# EAGLE design M_D_ext_power_usb_centered (EAGLE 9.6.2)
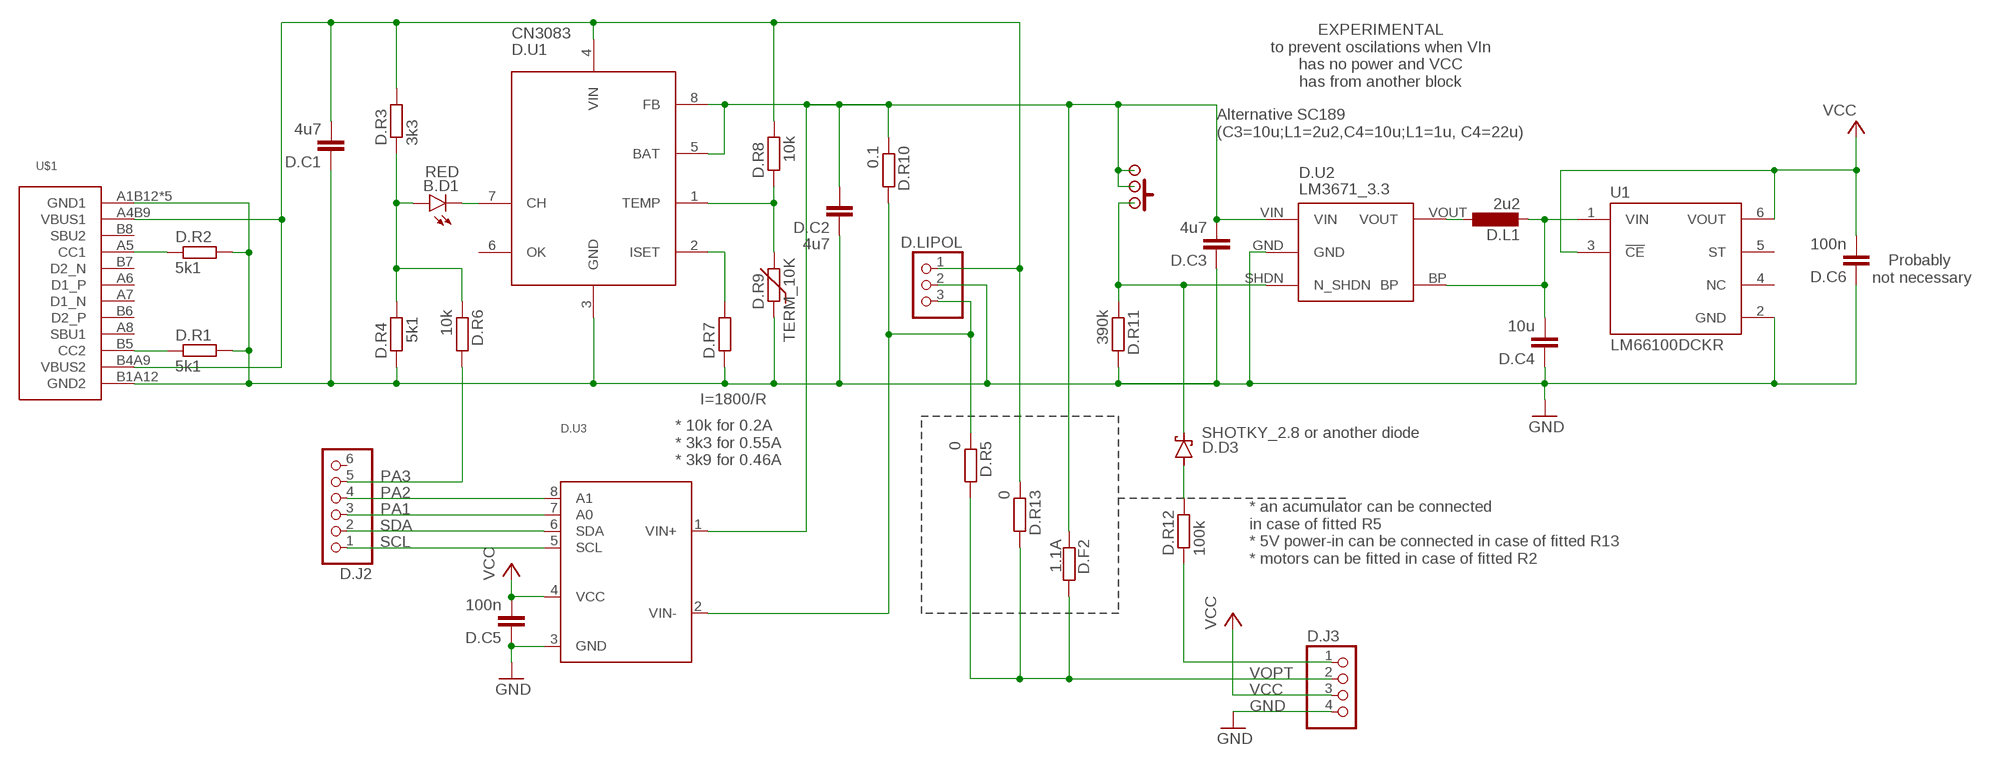
[diagram p0: schematic, sheet 1]

## Parts
B.D1  RED  LEDCHIP-LED0603  [CHIP-LED0603]
D.C1  4u7  C-EUC0603  [C0603]
D.C2  4u7  C-EUC0603  [C0603]
D.C3  4u7  C-EUC0603  [C0603]
D.C4  10u  C-EUC0603  [C0603]
D.C5  100n  C-EUC0603  [C0603]
D.C6  100n  C-EUC0603  [C0603]
D.D3  SHOTKY_2.8 or another diode  SHOTKY_2.8  [SHOTKY_2.8]
D.F2  1.1A  R-EU_R0805  [R0805]
D.J2  PINHD-1X6  [1X06]
D.J3  PINHD-1X4  [1X04]
D.L1  2u2  L-EUL3230M  [L3230M]
D.LIPOL  PINHEAD-1X3-2  [1X-03-2]
D.ON/OFF/RESET  SWITCH  [SWITCH]
D.R1  5k1  R-EU_R0603  [R0603]
D.R2  5k1  R-EU_R0603  [R0603]
D.R3  3k3  R-EU_R0603  [R0603]
D.R4  5k1  R-EU_R0603  [R0603]
D.R5  0  R-EU_R0603  [R0603]
D.R6  10k  R-EU_R0603  [R0603]
D.R7  I=1800/R  R-EU_R0603  [R0603]
D.R8  10k  R-EU_R0603  [R0603]
D.R9  TERM_10K  THERM  [THERM]
D.R10  0.1  R-EU_R0805  [R0805]
D.R11  390k  R-EU_R0603  [R0603]
D.R12  100k  R-EU_R0603  [R0603]
D.R13  0  R-EU_R0603  [R0603]
D.U1  CN3083  [SOP8]
D.U2  LM3671_3.3  STABILISER_APE8865  [SOT32-5]
D.U3  INA219  [SOT23-8]
U1  LM66100DCKR  [SOT65P210X110-6N]
U$1  USB-C  [USB-C]

## Nets
5V: D.C1.2 D.LIPOL.1 D.R3.2 D.R8.2 D.R13.1 D.U1.4(VIN) U$1.A4B9(VBUS1) U$1.B4A9(VBUS2)
CHRG: B.D1.A1(A) D.R3.1 D.R4.2 D.R6.1
GND: D.C1.1 D.C2.1 D.C3.1 D.C4.1 D.C5.1 D.C6.1 D.J3.4 D.LIPOL.2 D.R1.2 D.R2.2 D.R4.1 D.R7.1 D.R9.1 D.R11.2 D.U1.3(GND) D.U2.GND D.U3.3(GND) U1.2(GND) U$1.A1B12(GND1) U$1.B1A12(GND2) U$1.SH1(GND1) U$1.SH2(GND1) U$1.SH3(GND1) U$1.SH4(GND1)
IN+: D.C2.2 D.C3.2 D.F2.1 D.ON/OFF/RESET.P$2 D.ON/OFF/RESET.P$3 D.ON/OFF/RESET.P$4 D.ON/OFF/RESET.P$6 D.R10.1 D.U1.5(BAT) D.U1.8(FB) D.U2.VIN D.U3.1(VIN+)
IN-: D.LIPOL.3 D.R5.1 D.R10.2 D.U3.2(VIN-)
N$2: D.L1.1 D.U2.VOUT
N$3: B.D1.C1(C) D.U1.7(CH)
N$4: D.R1.1 U$1.B5(CC2)
N$5: D.D3.A D.R12.2
N$6: D.R2.1 U$1.A5(CC1)
N$7: D.R7.2 D.U1.2(ISET)
N$8: D.R8.1 D.R9.2 D.U1.1(TEMP)
N$10: D.D3.K(C) D.ON/OFF/RESET.P$1 D.ON/OFF/RESET.P$5 D.ON/OFF/RESET.P$7 D.R11.1 D.U2.SHDN(N_SHDN)
PA1: D.J2.3 D.U3.7(A0)
PA2: D.J2.4 D.U3.8(A1)
PA3: D.J2.5 D.R6.2
PA5-1: D.J3.1 D.R12.1
SCL: D.J2.1 D.U3.5(SCL)
SDA: D.J2.2 D.U3.6(SDA)
VCC: D.C5.2 D.C6.2 D.J3.3 D.U3.4(VCC) U1.3(!CE) U1.6(VOUT)
VCC1: D.C4.2 D.L1.2 D.U2.BP U1.1(VIN)
VOPT: D.F2.2 D.J3.2 D.R5.2 D.R13.2
Unconnected: D.J2.6 D.U1.6(OK) U1.4(NC) U1.5(ST) U$1.A6(D1_P) U$1.A7(D1_N) U$1.A8(SBU1) U$1.B6(D2_P) U$1.B7(D2_N) U$1.B8(SBU2)

## Notes on the sheet
- EXPERIMENTAL
  to prevent oscilations when VIn
  has no power and VCC
  has from another block
- Alternative SC189
  (C3=10u;L1=2u2,C4=10u;L1=1u, C4=22u)
- Probably 
  not necessary
- * 10k for 0.2A
  * 3k3 for 0.55A
  * 3k9 for 0.46A
- * an acumulator can be connected 
  in case of fitted R5  
  * 5V power-in can be connected in case of fitted R13 
  * motors can be fitted in case of fitted R2

## Library data of the parts
B.D1 = led:LED: LED OSRAM: - CHIPLED LG R971, LG N971, LY N971, LG Q971, LY Q971, LO R971, LY R971 LH N974, LH R974 LS Q976, LO Q976, LY Q976 LO Q996 - Hyper CHIPLED LW Q18S LB Q993, LB Q99A, LB R99A - SideLED LS A670, LO A670, LY A670, LG A670, LP A670 LB A673, LV A673, LT A673, LW A673 LH A674 LY A675 LS A676, LA A676, LO A676, LY A676, LW A676 LS A679, LY A679, LG A679 - Hyper Micro SIDELED® LS Y876, LA Y876, LO Y876, LY Y876 LT Y87S - SmartLED LW L88C, LW L88S LB L89C, LB L89S, LG L890 LS L89K, LO L89K, LY L89K LS L896, LA L896, LO L896, LY L896 - TOPLED LS T670, LO T670, LY T670, LG T670, LP T670 LSG T670, LSP T670, LSY T670, LOP T670, LYG T670 LG T671, LOG T671, LSG T671 LB T673, LV T673, LT T673, LW T673 LH T674 LS T676, LA T676, LO T676, LY T676, LB T676, LH T676, LSB T676, LW T676 LB T67C, LV T67C, LT T67C, LS T67K, LO T67K, LY T67K, LW E67C LS E67B, LA E67B, LO E67B, LY E67B, LB E67C, LV E67C, LT E67C LW T67C LS T679, LY T679, LG T679 LS T770, LO T770, LY T770, LG T770, LP T770 LB T773, LV T773, LT T773, LW T773 LH T774 LS E675, LA E675, LY E675, LS T675 LS T776, LA T776, LO T776, LY T776, LB T776 LHGB T686 LT T68C, LB T68C - Hyper Mini TOPLED® LB M676 - Mini TOPLED Santana® LG M470 LS M47K, LO M47K, LY M47K Source: http://www.osram.convergy.de LUXEON: - LUMILED® LXK2-PW12-R00, LXK2-PW12-S00, LXK2-PW14-U00, LXK2-PW14-V00 LXK2-PM12-R00, LXK2-PM12-S00, LXK2-PM14-U00 LXK2-PE12-Q00, LXK2-PE12-R00, LXK2-PE12-S00, LXK2-PE14-T00, LXK2-PE14-U00 LXK2-PB12-K00, LXK2-PB12-L00, LXK2-PB12-M00, LXK2-PB14-N00, LXK2-PB14-P00, LXK2-PB14-Q00 LXK2-PR12-L00, LXK2-PR12-M00, LXK2-PR14-Q00, LXK2-PR14-R00 LXK2-PD12-Q00, LXK2-PD12-R00, LXK2-PD12-S00 LXK2-PH12-R00, LXK2-PH12-S00 LXK2-PL12-P00, LXK2-PL12-Q00, LXK2-PL12-R00 Source: www.luxeon.com KINGBRIGHT: KA-3528ASYC Source: www.kingbright.com
D.C1-D.C6 = rcl:C-EU: CAPACITOR, European symbol; SPICEPREFIX: C
D.D3 = hugo:SHOTKY_2.8
D.F2 D.R1-D.R8 D.R10-D.R13 = rcl:R-EU_: RESISTOR, European symbol; SPICEPREFIX: R
D.J2 = pinhead2:PINHD-1X6: PIN HEADER
D.J3 = pinhead2:PINHD-1X4: PIN HEADER
D.L1 = rcl:L-EU: INDUCTOR, European symbol; SPICEPREFIX: L
D.LIPOL = pinhead2:PINHEAD-1X3-2
D.ON/OFF/RESET = hugo:SWITCH
D.R9 = hugo:THERM
D.U1 = hugo:CN3083
D.U2 = !stavebnice03:STABILISER_APE8865
D.U3 = hugo:INA219: INA219 - I2C Current/Power Monitor Voltage Range: 0-26V Accuracy: 0.5% Temperature: -40°C - 125°C
U1 = LM66100DCKR:LM66100DCKR: Check availability <https://pricing.snapeda.com/parts/LM66100DCKR/Texas%20Instruments/view-part?ref=eda>; AVAILABILITY: In Stock; CHECK_PRICES: https://www.snapeda.com/parts/LM66100DCKR/Texas+Instruments/view-part/?ref=eda; DESCRIPTION: 1.5-V to 5.5-V, 1.5-A, 0.5-µA IQ ideal diode with integrated FET; MF: Texas Instruments; MP: LM66100DCKR; PACKAGE: SOT-SC70-6 Texas Instruments; PRICE: None; SNAPEDA_LINK: https://www.snapeda.com/parts/LM66100DCKR/Texas+Instruments/view-part/?ref=snap
U$1 = hugo:USB-C

## Board
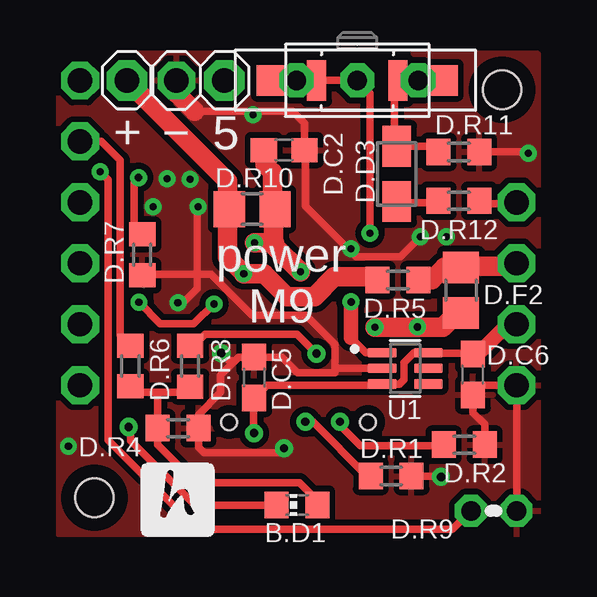
[diagram p1: board, top side]
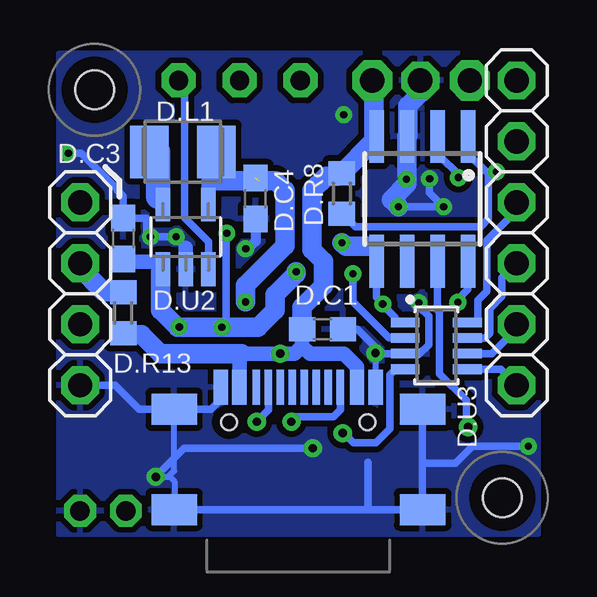
[diagram p2: board, bottom side, seen from below]

No outline drawn. Coordinates in mm, seen from the top.
Copper layers (1*16): Top 0.035mm / dielectric 1.5mm / Bottom 0.035mm
Design rules "default *": minimum track width 10mil, minimum drill 0.3mm, track to track 6mil, track to pad 6mil, pad to pad 6mil, via to via 10mil, smd to smd 10mil, copper to edge 15mil, drill to drill 15mil, minimum pad ring 10mil, minimum via ring 8mil, stop-mask expansion 4mil, vias tented up to drill 14mil, thermal gap 10mil
Holes 1.6 mm at 2,2 19,19
tRestrict: area 18,18 to 20,20; area 1,1 to 3,3
bRestrict: area 1,1 to 3,3; area 18,18 to 20,20

### Footprints (pad centres in the part's own frame; a part is rotated, then mirrored left to right if it is on the bottom)
CHIP-LED0603 = smd 1.1 x 1: A1 0,-0.85; C1 0,0.85
C0603 = smd 1.1 x 1: 1 -0.85,0; 2 0.85,0
SHOTKY_2.8 = smd 1.7 x 1.2: A -1.15,0; K 1.15,0
R0805 = smd 1.3 x 1.5: 1 -0.95,0; 2 0.95,0
1X06 = drill 1.016 pad 1.575 octagon: 1 -6.35,0; 2 -3.81,0; 3 -1.27,0; 4 1.27,0; 5 3.81,0; 6 6.35,0
1X04 = drill 1.016 pad 1.575 octagon: 1 -3.81,0; 2 -1.27,0; 3 1.27,0; 4 3.81,0
L3230M = smd 1.6 x 2.2: 1 -1.4,0; 2 1.4,0
1X-03-2 = drill 1.016 pad 1.676 octagon: 1 -2.016,0; 3 2.048,0 | drill 1.016 pad 1.575 octagon: 2 -0.016,0
SWITCH = drill 0.8 pad 1.422 octagon: P$1 2.54,0; P$2 0,0; P$3 -2.54,0 | smd 0.8 x 1.7: P$4 -1.7,0; P$5 1.7,0 | smd 1.27 x 1.27: P$6 -3.556,0; P$7 3.556,0
R0603 = smd 1 x 1.1: 1 -0.85,0; 2 0.85,0
THERM = drill 0.813 octagon: 1 -0.953,0; 2 0.953,0
SOP8 = smd 0.6 x 2.2: 1 -1.905,-2.6; 2 -0.635,-2.6; 3 0.635,-2.6; 4 1.905,-2.6; 5 1.905,2.6; 6 0.635,2.6; 7 -0.635,2.6; 8 -1.905,2.6
SOT32-5 = smd 0.6 x 1.4: BP 0.95,1.35; GND 0,-1.35; SHDN 0.95,-1.35; VIN -0.95,-1.35; VOUT -0.95,1.35
SOT23-8 = smd 0.4 x 1.2: 1 -0.975,-1.3; 2 -0.325,-1.3; 3 0.325,-1.3; 4 0.975,-1.3; 5 0.975,1.3; 6 0.325,1.3; 7 -0.325,1.3; 8 -0.975,1.3
SOT65P210X110-6N = smd 1.19 x 0.4: 1 -0.96,0.65; 2 -0.96,0; 3 -0.96,-0.65; 4 0.96,-0.65; 5 0.96,0; 6 0.96,0.65
USB-C = smd 0.6 x 1.45: A1B12 -3.235,3.825; A4B9 -2.46,3.825; B1A12 3.215,3.825; B4A9 2.44,3.825 | smd 0.3 x 1.45: A5 -1.26,3.825; A6 -0.26,3.825; A7 0.24,3.825; A8 1.24,3.825; B5 1.74,3.825; B6 0.74,3.825; B7 -0.76,3.825; B8 -1.76,3.825 | smd 1.9 x 1.3: SH1 -5.18,2.91; SH2 -5.18,-1.27; SH3 5.18,-1.27; SH4 5.18,2.91 | hole 0.65: 2.88,2.38; -2.9,2.38

### Placement (x,y rotation side)
B.D1  10.45,1.7 90 top
D.C1  9.49,9.03 180 bottom
D.C2  9.91,16.49 180 top
D.C3  17.81,12.8 270 bottom
D.C4  12.29,14.47 90 bottom
D.C5  8.66,7.01 270 top
D.C6  17.78,7.14 90 top
D.D3  14.61,15.49 90 top
D.F2  17.29,10.65 90 top
D.J2  1.4,13.04 90 bottom
D.J3  19.6,10.5 270 bottom
D.L1  15.32,16.41 0 bottom
D.LIPOL  5.4,19.39 180 top
D.ON/OFF/RESET  12.96,19.39 0 top
D.R1  14.37,2.91 0 top
D.R2  17.42,4.22 0 top
D.R3  5.99,7.48 90 top
D.R4  5.48,4.9 180 top
D.R5  14.66,11.07 0 top
D.R6  3.5,7.49 90 top
D.R7  4,12.12 90 top
D.R8  8.69,14.68 90 bottom
D.R9  18.65,1.46 180 top
D.R10  8.58,14.03 180 top
D.R11  17.2,16.41 0 top
D.R12  17.2,14.38 180 top
D.R13  17.81,9.7 90 bottom
D.U1  5.33,14.45 180 bottom
D.U2  15.2,12.87 0 bottom
D.U3  4.75,8.33 270 bottom
U1  14.96,7.39 0 top
U$1  10.5,2.78 0 bottom

### Tracks (layer width: path | path; a pad name or v marks a point on that pad's centre or on a via)
5V  (via drill 0.35)
  Top 0.305: D.R3.2 6.14,8.34 6.62,8.82 10.45,8.82 v11.26,8.01
  Bottom 0.61: D.R8.2 8.74,15.53 8.87,15.4 | U$1.A4B9 12.96,7.93 | 7.34,17.15 D.U1.4 7.24,17 7.34,16.9 | 12.88,8.01 v11.26,8.01 10.65,8.01 10.4,8.26 10.34,8.19 10.34,8.32 | U$1.B4A9 8.06,7.45 8.61,8 10.02,8 10.34,8.32 | 10.34,8.32 D.C1.2
  Bottom 0.813: D.R8.2 7.34,16.88 7.34,16.9 | 8.87,15.4 9.34,15.4 9.93,14.81 9.93,12.32 9.45,11.84 9.45,10.82 10.34,9.93 D.C1.2 | 12.88,8.01 16.25,8.01 17.04,8.8 17.75,8.8 D.R13.1 | 7.34,17.15 7.34,18.88 7.67,19.21 D.LIPOL.1 | 12.88,8.01 | 12.88,8.01 12.96,7.93
CHRG
  Top 0.305: D.R6.1 3.75,6.39 4.67,6.39 | D.R3.1 5.74,6.39 4.67,6.39 | D.R4.2 4.63,4.32 | D.R4.2 4.63,6.35 4.67,6.39 | B.D1.A1 11.49,1.7 10.56,2.63 6.22,2.63 4.63,4.22 D.R4.2
GND  (via drill 0.3, 0.35)
  Top 0.305: 6.29,11.3 6.29,10.71 5.7,10.12 v5.48,10.12 | 6.29,11.3 6.29,14.12 v6.33,14.12 | D.R11.2 20.04,16.41 v20.09,16.36 | v15.6,12.88 14.76,12.04 12.9,12.04 12.63,12.31 | 6.17,18.11 10.26,18.11 10.76,17.61 D.C2.1 10.8,16.49 10.8,14.15 12.63,12.31 | D.R7.1 4.03,11.3 6.29,11.3 | v12.7,12.37 12.63,12.31 | 13.19,7.39 U1.2 12.04,7.39 | 6.29,11.3 6.86,11.3 8.56,9.6 10.83,9.6 12.04,8.39 12.04,7.39 | D.C6.1 18.18,6.69 D.J3.4 D.R9.1 | D.R4.1 6.33,4.12 6.34,4.12 6.58,3.88 9.77,3.88 9.91,4.02 v9.91,4.06 | D.R4.1 6.15,5.09 | D.C6.1 17.71,6.22 | D.C6.1 17.83,6.24 17.75,6.16 | 7.86,7.71 8.01,7.86 D.C5.1 9.83,7.86 10.48,7.21 12.04,7.21 12.04,7.39 | 7.86,7.71 7.26,7.11 7.26,6.4 6.33,5.46 D.R4.1 | v7.29,8.03 7.61,7.71 7.86,7.71 | D.C6.1 17.78,5.55 18.27,5.05 D.R2.2 | D.R1.2 16.42,2.91 v16.45,2.87
  Top 0.61: 5.44,18.84 5.42,18.89 D.LIPOL.2
  Top 0.813: 6.17,18.11 5.44,18.84
  Bottom 0.254: U$1.B1A12 7.26,7.77 7.02,8.01 | 15.66,1.51 15.67,2.69 15.86,2.87 v16.45,2.87 15.93,2.87 15.68,3.12 U$1.SH1
  Bottom 0.305: U$1.SH3 7.59,1.51 | 7.59,1.51 15.66,1.51 | 15.6,1.51 U$1.SH2 | 5.38,5.71 U$1.SH4 5.32,3.48 | 5.18,1.28 U$1.SH3 | v20.09,16.36 19.56,16.36 18.06,14.86 18.06,14.82 17.8,14.57 D.C3.1 16.84,13.65 16.84,13.12 16.82,13.12 16.59,12.88 15.68,12.88 15.2,12.41 | v0.91,4.14 3.24,4.14 3.95,3.44 5.28,3.44 5.32,3.48 | 6.96,8.01 D.U3.3 6.03,7.98 5.47,7.98 5.07,8.38 5.07,9.56 5.48,9.97 v5.48,10.12 | v6.33,14.12 v4.45,14.12 5.03,14.71 v5.03,15.29 | 7.59,3.48 7.59,1.51 | 5.32,3.48 U$1.SH3 | D.J3.4 18.15,6.69 17.15,5.69 U$1.SH1 14.15,5.69 13.73,6.1 U$1.A1B12 | v9.91,4.06 15.26,4.06 v16.45,2.87 | D.C1.1 8.04,9.03 7.02,8.01
  Bottom 0.406: v12.7,12.37 12.6,12.37 12.29,12.68 D.C4.1
  Bottom 0.61: U$1.SH4 5.28,5.82 | D.U1.3 5.97,18.23 | D.U2.GND 15.2,12.41 | D.LIPOL.2 5.42,18.86
  Bottom 0.813: v6.33,14.12 6.63,14.43 5.97,15.09 D.U1.3 5.94,17.08 5.94,18.33 5.42,18.86
  other vias: 5.99,15.27 16.67,12.88 8.61,17.96
  pour Top (isolate 0.254): 0.5,20.5 0.5,0.5 20.5,0.5 20.5,20.5
  pour Bottom (isolate 0.254, rank 3): 0.5,20.5 20.5,20.5 20.5,0.5 0.5,0.5
IN+  (via drill 0.3)
  Top 0.305: D.ON/OFF/RESET.P$6 D.ON/OFF/RESET.P$3 D.ON/OFF/RESET.P$4 D.ON/OFF/RESET.P$2 13.5,18.85 v13.5,13.03 v13.48,13.02 | v3.85,10.15 4.74,9.26 6.13,9.26 v6.99,10.07
  Top 0.508: 14.79,9.1 15.32,9.1
  Top 0.61: v8.68,12.62 9.52,12.62
  Top 0.813: D.R10.1 9.42,14.13 9.42,15.57 9.11,15.88 9.11,16.44 D.C2.2 | D.R10.1 9.61,14.03 | D.R10.1 9.47,13.97 9.47,12.62 v8.68,12.62 | 17.35,9.6 17.35,9.64 D.F2.1 17.14,9.7 16.54,9.1 15.45,9.1 | v15.47,9.12 15.45,9.1 | 15.45,9.1 15.32,9.1 14.83,9.1 | v13.69,9.1 14.79,9.1 | 9.52,12.62 9.52,12.49 v10.59,11.42
  Bottom 0.305: D.U2.VIN 16.15,11.82 | D.C3.2 17.59,11.74 17.6,11.82 | v13.48,13.02 13.51,12.99 13.51,9.28 v13.69,9.1 | D.U3.1 6.48,9.31 6.48,9.52 6.99,10.02 v6.99,10.07 7.24,10.36 D.U1.5 | v3.85,10.15 3.85,10.26 3.43,10.68 D.U1.8
  Bottom 0.508: 7.37,12.47 7.24,12.6 | 7.24,12.42 7.19,12.47
  Bottom 0.61: 7.24,12.45 D.U1.5 7.24,12.42 7.24,12.6 | 17.6,11.82 16.15,11.82 | D.U2.VIN 16.25,11.42
  Bottom 0.813: v8.68,12.62 8.53,12.47 7.37,12.47 | 16.25,11.42 16.25,9.82 15.54,9.1 v13.69,9.1 12.19,9.1 11.48,9.8 11.48,10.45 10.59,11.34 v10.59,11.42
IN-  (via drill 0.3)
  Top 0.813: D.LIPOL.3 7.55,15.19 7.55,14.33 7.62,14.25 D.R10.2 7.62,13.57 7.54,13.49 7.54,12.03 8.23,11.35 v8.23,11.33 9.06,11.33 10.02,10.38 11.17,10.38 11.99,11.2 13.68,11.2 D.R5.1
  Bottom 0.305: D.U3.2 6.07,8.67 6.74,8.67 8.23,10.16 v8.23,11.33
N$2
  Bottom 0.61: D.U2.VOUT 16.15,14.35 16.36,14.55 | D.L1.1 16.36,16.41
  Bottom 1.016: 16.36,16.41 16.36,14.55
N$3  (via drill 0.35)
  Top 0.305: v3.42,4.95 3.5,4.88 3.5,4.38 6.2,1.68 9.38,1.68 B.D1.C1
  Bottom 0.305: 4.75,11.8 D.U1.7 4.7,9.83 4.61,9.75 4.61,7.16 3.5,6.05 3.5,5.03 v3.42,4.95
N$4  (via drill 0.35)
  Top 0.305: D.R1.1 13.37,2.91 11.11,5.17 v10.79,5.17
  Bottom 0.305: v10.79,5.17 10.58,5.38 9.04,5.38 8.75,5.67 U$1.B5
N$5
  Top 0.305: D.D3.A 14.81,14.3 16.27,14.3 D.R12.2
N$6  (via drill 0.35)
  Top 0.305: v12.24,5.17 12.24,5.02 13.09,4.17 16.52,4.17 D.R2.1
  Bottom 0.305: U$1.A5 11.75,5.67 12.24,5.19 v12.24,5.17
N$7  (via drill 0.3)
  Top 0.305: v3.83,15.34 3.66,15.16 3.66,13.31 D.R7.2
  Bottom 0.305: D.U1.2 4.57,16.93 4.57,16.21 3.83,15.48 v3.83,15.34
N$8  (via drill 0.3)
  Top 0.305: v2.24,15.59 2.56,15.26 2.56,4.4 6.28,0.69 16.93,0.69 D.R9.2
  Bottom 0.305: 8.61,13.83 D.R8.1 8.66,13.83 8.13,13.3 2.9,13.3 2.57,13.63 2.57,15.43 2.42,15.59 v2.24,15.59 2.67,15.59 3.4,16.32 3.4,17.03 D.U1.1
N$10
  Top 0.305: 14.97,17.26 D.D3.K | D.ON/OFF/RESET.P$1 D.ON/OFF/RESET.P$5 14.51,19.2 14.51,16.94 D.D3.K | D.ON/OFF/RESET.P$1 15.36,19.35 | D.ON/OFF/RESET.P$1 D.ON/OFF/RESET.P$7 | D.R11.1 16.11,16.64 14.88,16.64 | 14.88,16.64 | 14.88,16.64 D.D3.K
  Bottom 0.305: D.U2.SHDN 14.25,12.66 15.25,13.66 15.25,19.14 D.ON/OFF/RESET.P$1
PA1
  Bottom 0.305: D.J2.3 2.01,11.16 2.01,10.39 2.52,9.89 2.52,8.86 2.72,8.66 D.U3.7
PA2
  Bottom 0.305: D.J2.4 1.4,13.98 2.65,12.73 2.65,10.6 3.02,10.23 3.02,9.31 D.U3.8
PA3
  Top 0.305: D.R6.2 3.07,8.77 3.07,16.07 2.29,16.85 D.J2.5
PA5-1
  Top 0.305: D.R12.1 18.01,14.26 19.55,14.26 D.J3.1
SCL
  Bottom 0.305: D.U3.5 2.07,7.36 D.J2.1
SDA
  Bottom 0.305: D.J2.2 1.4,9.04 2.44,8.01 D.U3.6
VCC  (via drill 0.35)
  Top 0.305: 18.04,8.02 15.94,8.02 U1.6 15.32,8.04 14.9,7.62 14.9,6.92 14.72,6.73 U1.3 13.95,6.69 9.19,6.69 D.C5.2 8.63,6.13 8.63,4.72 v8.65,4.69 | D.C6.2 19.02,9.23 D.J3.3 | v8.65,4.69 8.7,4.74 8.7,4.78 | v8.65,4.69 8.65,4.81
  Top 0.61: 18.04,8.02 19.24,9.23 D.J3.3
  Bottom 0.305: D.U3.4 6.46,7.36 6.68,7.13 6.68,4.88 7.26,4.3 8.2,4.3 8.6,4.69 v8.65,4.69
VCC1  (via drill 0.3)  (1 unrouted)
  Top 0.305: U1.1 13.32,8.04 12.7,8.66
  Top 0.61: v12.7,10.16 12.7,8.66
  Bottom 0.406: D.U2.BP 14.25,14.45
  Bottom 0.508: 14.25,16.07 D.L1.2
  Bottom 0.61: D.U2.BP 14.25,16.07
  Bottom 0.813: v12.7,10.16 12.7,10.85 11.05,12.5 11.05,14.81 11.45,15.21 12.13,15.21 | 14.07,16.25 D.L1.2 13.92,15.9 | 13.92,15.9 13.89,15.88 | 13.92,15.9 13.92,15.21 12.39,15.21 D.C4.2
VOPT
  Top 0.813: D.J3.2 19.47,11.64 17.33,11.64 D.F2.2 16.6,11.6 16.08,11.07 D.R5.2
  Bottom 0.813: D.R13.2 17.84,10.59 18.61,10.59 19.6,11.58 D.J3.2

### Text on the board
tPlace: + | − | 5 | power / M9